# Altium schematic sheet Kilobot_Controller_ISP.SchDoc
size A4
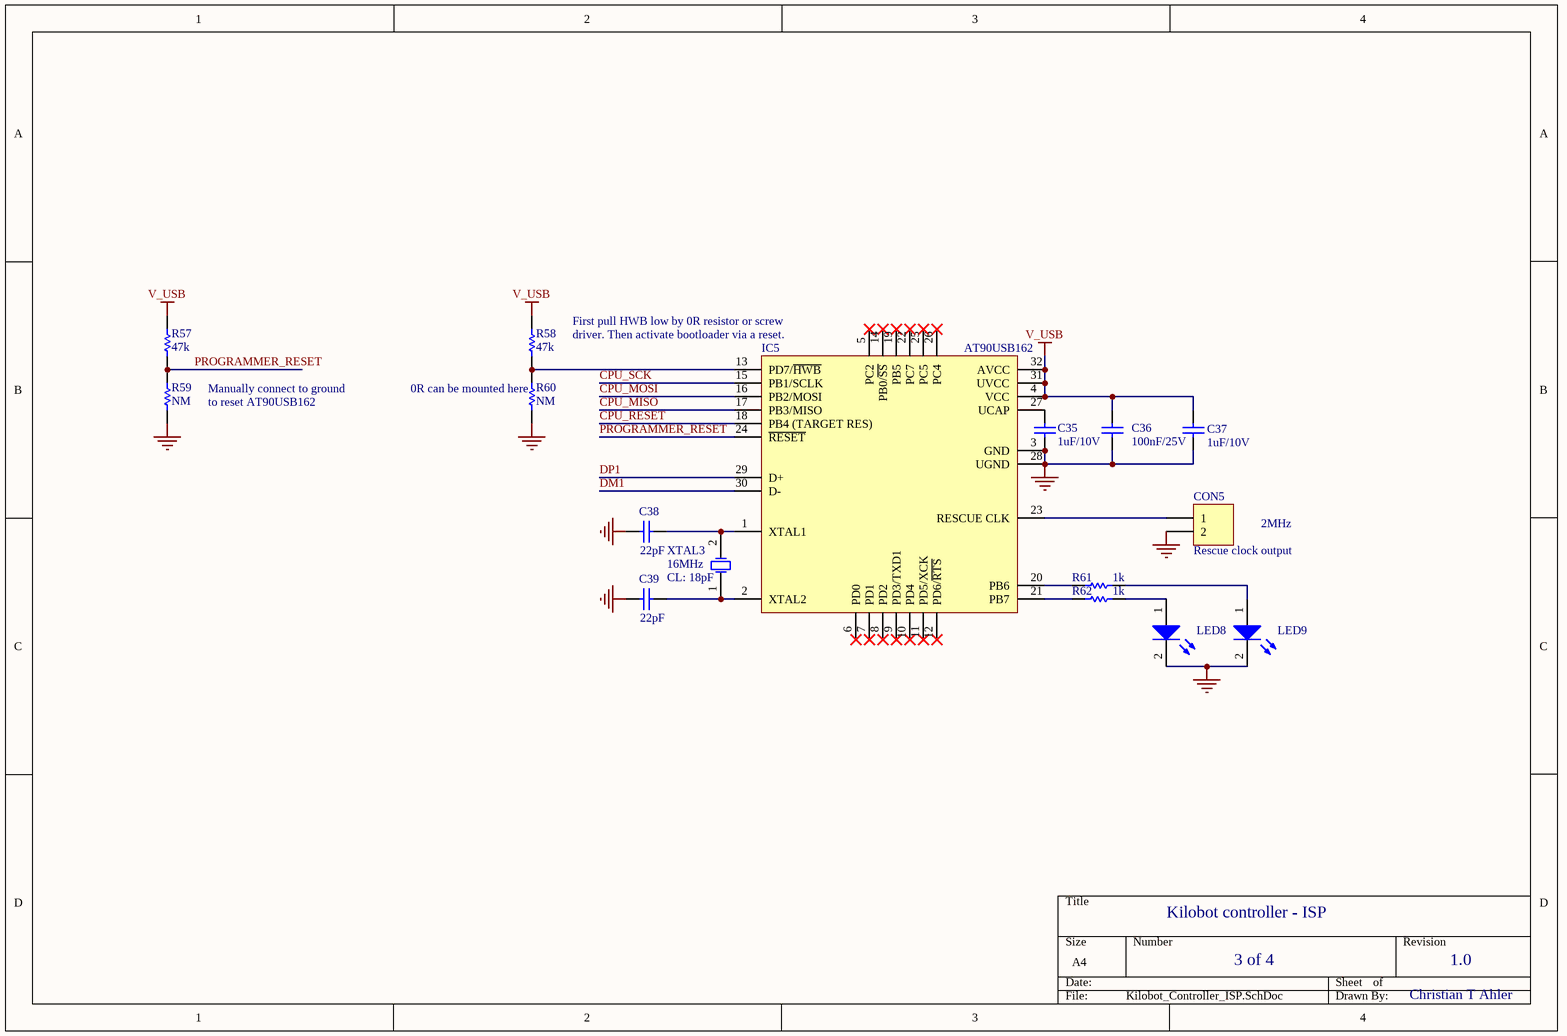
[diagram p0: Kilobot_Controller_ISP.SchDoc]

## Parts
C35  value 1uF/10V  [RESC1608L]  (hidden comment: C0603)
C36  value 100nF/25V  [RESC1608L]  (hidden comment: C0603)
C37  value 1uF/10V  [RESC1608L]  (hidden comment: C0603)
C38  value 22pF  [RESC1608L]  (hidden comment: C0603)
C39  value 22pF  [RESC1608L]  (hidden comment: C0603)
CON5  Rescue clock output  [HDR1X2]
IC5  AT90USB162  [TQFP32]
LED8  LED  [LED0603]  (value not drawn)
LED9  LED  [LED0603]  (value not drawn)
R57  value 47k  [RESC1608L]  (hidden comment: Res1)
R58  value 47k  [RESC1608L]  (hidden comment: Res1)
R59  value NM  [RESC1608L]  (hidden comment: Res1)
R60  value NM  [RESC1608L]  (hidden comment: Res1)
R61  value 1k  [RESC1608L]  (hidden comment: Res1)
R62  value 1k  [RESC1608L]  (hidden comment: Res1)
XTAL3  value 16MHz  CL: 18pF  [crystal-hc49]  (hidden comment: Crystal)

## Nets
GND: C35.1 C36.2 C37.1 C38.1 C39.1 CON5.2 IC5.3(GND) IC5.28(UGND) LED8.2(K) LED9.2(K) R59.2 R60.2
V_USB: C36.1 C37.2 IC5.4(VCC) IC5.31(UVCC) IC5.32(AVCC) R57.1 R58.1
CPU_MISO: IC5.17(PB3/MISO)
CPU_MOSI: IC5.16(PB2/MOSI)
CPU_RESET: IC5.18(PB4_(TARGET_RES))
CPU_SCK: IC5.15(PB1/SCLK)
DM1: IC5.30(D-)
DP1: IC5.29(D+)
PROGRAMMER_RESET: IC5.24(~{RESET}) R57.2 R59.1
NetC35_2: C35.2 IC5.27(UCAP)
NetC38_2: C38.2 IC5.1(XTAL1) XTAL3.2(OSC2)
NetC39_2: C39.2 IC5.2(XTAL2) XTAL3.1(OSC1)
NetCON5_1: CON5.1 IC5.23(RESCUE_CLK)
NetIC5_13: IC5.13(PD7/~{HWB}) R58.2 R60.1
NetIC5_20: IC5.20(PB6) R61.2
NetIC5_21: IC5.21(PB7) R62.2
NetLED8_1: LED8.1(A) R62.1
NetLED9_1: LED9.1(A) R61.1

Not connected (* = marked no-connect by the designer): IC5 5(PC2)* 6(PD0)* 7(PD1)* 8(PD2)* 9(PD3/TXD1)* 10(PD4)* 11(PD5/XCK)* 12(PD6/~{RTS})* 14(PB0/~{SS})* 19(PB5)* 22(PC7)* 25(PC5)* 26(PC4)*

## Notes on the sheet
- First pull HWB low by 0R resistor or screw
- (near IC5) driver. Then activate bootloader via a reset.
- Manually connect to ground
- to reset AT90USB162
- (near R60) 0R can be mounted here
- 2MHz
- Kilobot controller - ISP
- 3 of 4
- 1.0
- Christian T Ahler

## Library data of the parts
C35 C37 = C0603: Ceramic Chip Capacitor - Standard; Order code: 445-1328-1-ND
C36 = C0603: Ceramic Chip Capacitor - Standard; Order code: 445-1316-1-ND
C38 C39 = C0603: Ceramic Chip Capacitor - Standard; Order code: 445-1273-1-ND
CON5 = Header 2: Header, 2-Pin; Order code: 2 position pin header; Value: Rescue clock output
IC5 = AT90USB162: Order code: AT90USB162-16AU-ND; Value: AT90USB162
LED8 LED9 = LED: Value: LED Green; Order code: 475-1409-1-ND
R57 R58 = Res1: Resistor; Order code: P47.0KHCT-ND
R59 R60 = Res1: Resistor; Order code: DNO
R61 R62 = Res1: Resistor; Order code: P1.00KHCT-ND
XTAL3 = Crystal: Order code: 535-10226-1-ND